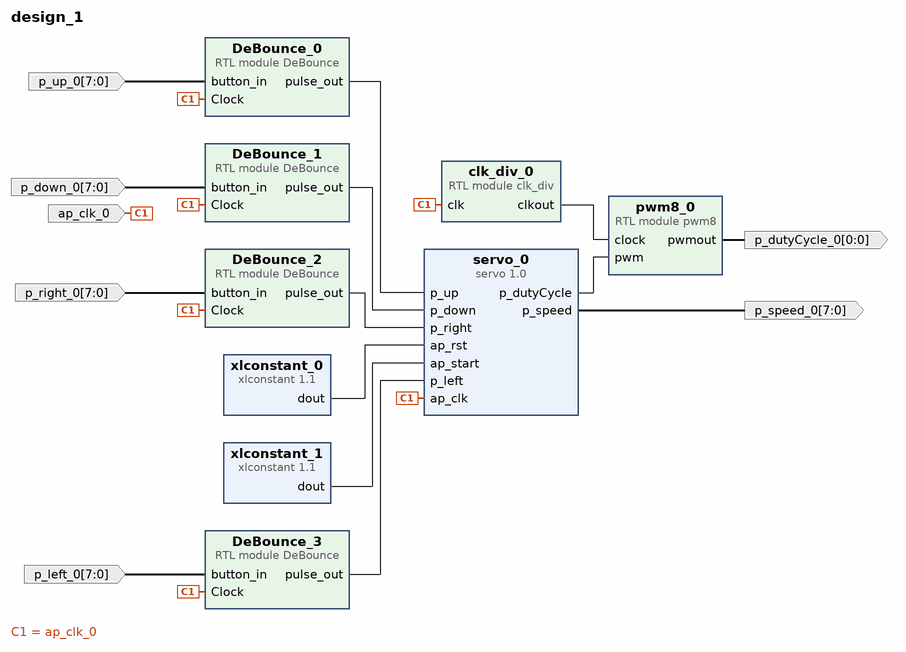
[diagram p0: block diagram of the top level]
# Vivado block design design_1, xc7z020clg484-1, Vivado 2019.2
create_bd_design design_1

create_bd_port -dir I -type clk ap_clk_0
create_bd_port -dir I -from 7 -to 0 -type data p_left_0
create_bd_port -dir I -from 7 -to 0 -type data p_down_0
create_bd_port -dir I -from 7 -to 0 -type data p_up_0
create_bd_port -dir O -from 7 -to 0 -type data p_speed_0
create_bd_port -dir I -from 7 -to 0 -type data p_right_0
create_bd_port -dir O -from 0 -to 0 -type data p_dutyCycle_0

create_bd_cell -type ip -vlnv xilinx.com:ip:xlconstant:1.1 xlconstant_0
set_property -dict {CONFIG.CONST_VAL 0} [get_bd_cells xlconstant_0]
create_bd_cell -type ip -vlnv xilinx.com:ip:xlconstant:1.1 xlconstant_1
create_bd_cell -type ip -vlnv xilinx.com:hls:servo:1.0 servo_0
create_bd_cell -type module -reference DeBounce DeBounce_0
create_bd_cell -type module -reference DeBounce DeBounce_1
create_bd_cell -type module -reference DeBounce DeBounce_2
create_bd_cell -type module -reference DeBounce DeBounce_3
create_bd_cell -type module -reference pwm8 pwm8_0
create_bd_cell -type module -reference clk_div clk_div_0

# ---- connections ----

connect_bd_net [get_bd_pins xlconstant_0/dout] [get_bd_pins servo_0/ap_rst]
connect_bd_net [get_bd_pins xlconstant_1/dout] [get_bd_pins servo_0/ap_start]
connect_bd_net -net ap_clk_0_1 [get_bd_ports ap_clk_0] \
  [get_bd_pins servo_0/ap_clk] [get_bd_pins DeBounce_0/Clock] [get_bd_pins DeBounce_1/Clock] [get_bd_pins DeBounce_3/Clock] \
  [get_bd_pins DeBounce_2/Clock] [get_bd_pins clk_div_0/clk]
connect_bd_net [get_bd_pins servo_0/p_speed] [get_bd_ports p_speed_0]
connect_bd_net [get_bd_pins DeBounce_2/pulse_out] [get_bd_pins servo_0/p_right]
connect_bd_net [get_bd_pins DeBounce_3/pulse_out] [get_bd_pins servo_0/p_left]
connect_bd_net [get_bd_pins DeBounce_1/pulse_out] [get_bd_pins servo_0/p_down]
connect_bd_net [get_bd_pins DeBounce_0/pulse_out] [get_bd_pins servo_0/p_up]
connect_bd_net -net p_right_0_1 [get_bd_ports p_right_0] [get_bd_pins DeBounce_2/button_in]
connect_bd_net -net p_left_0_1 [get_bd_ports p_left_0] [get_bd_pins DeBounce_3/button_in]
connect_bd_net -net p_down_0_1 [get_bd_ports p_down_0] [get_bd_pins DeBounce_1/button_in]
connect_bd_net -net p_up_0_1 [get_bd_ports p_up_0] [get_bd_pins DeBounce_0/button_in]
connect_bd_net [get_bd_pins pwm8_0/pwmout] [get_bd_ports p_dutyCycle_0]
connect_bd_net [get_bd_pins clk_div_0/clkout] [get_bd_pins pwm8_0/clock]
connect_bd_net [get_bd_pins servo_0/p_dutyCycle] [get_bd_pins pwm8_0/pwm]

validate_bd_design
save_bd_design
